# Altium schematic sheet MGT Banks 115-116.SchDoc
size A3; SheetNumber: 22; SheetTotal: 32
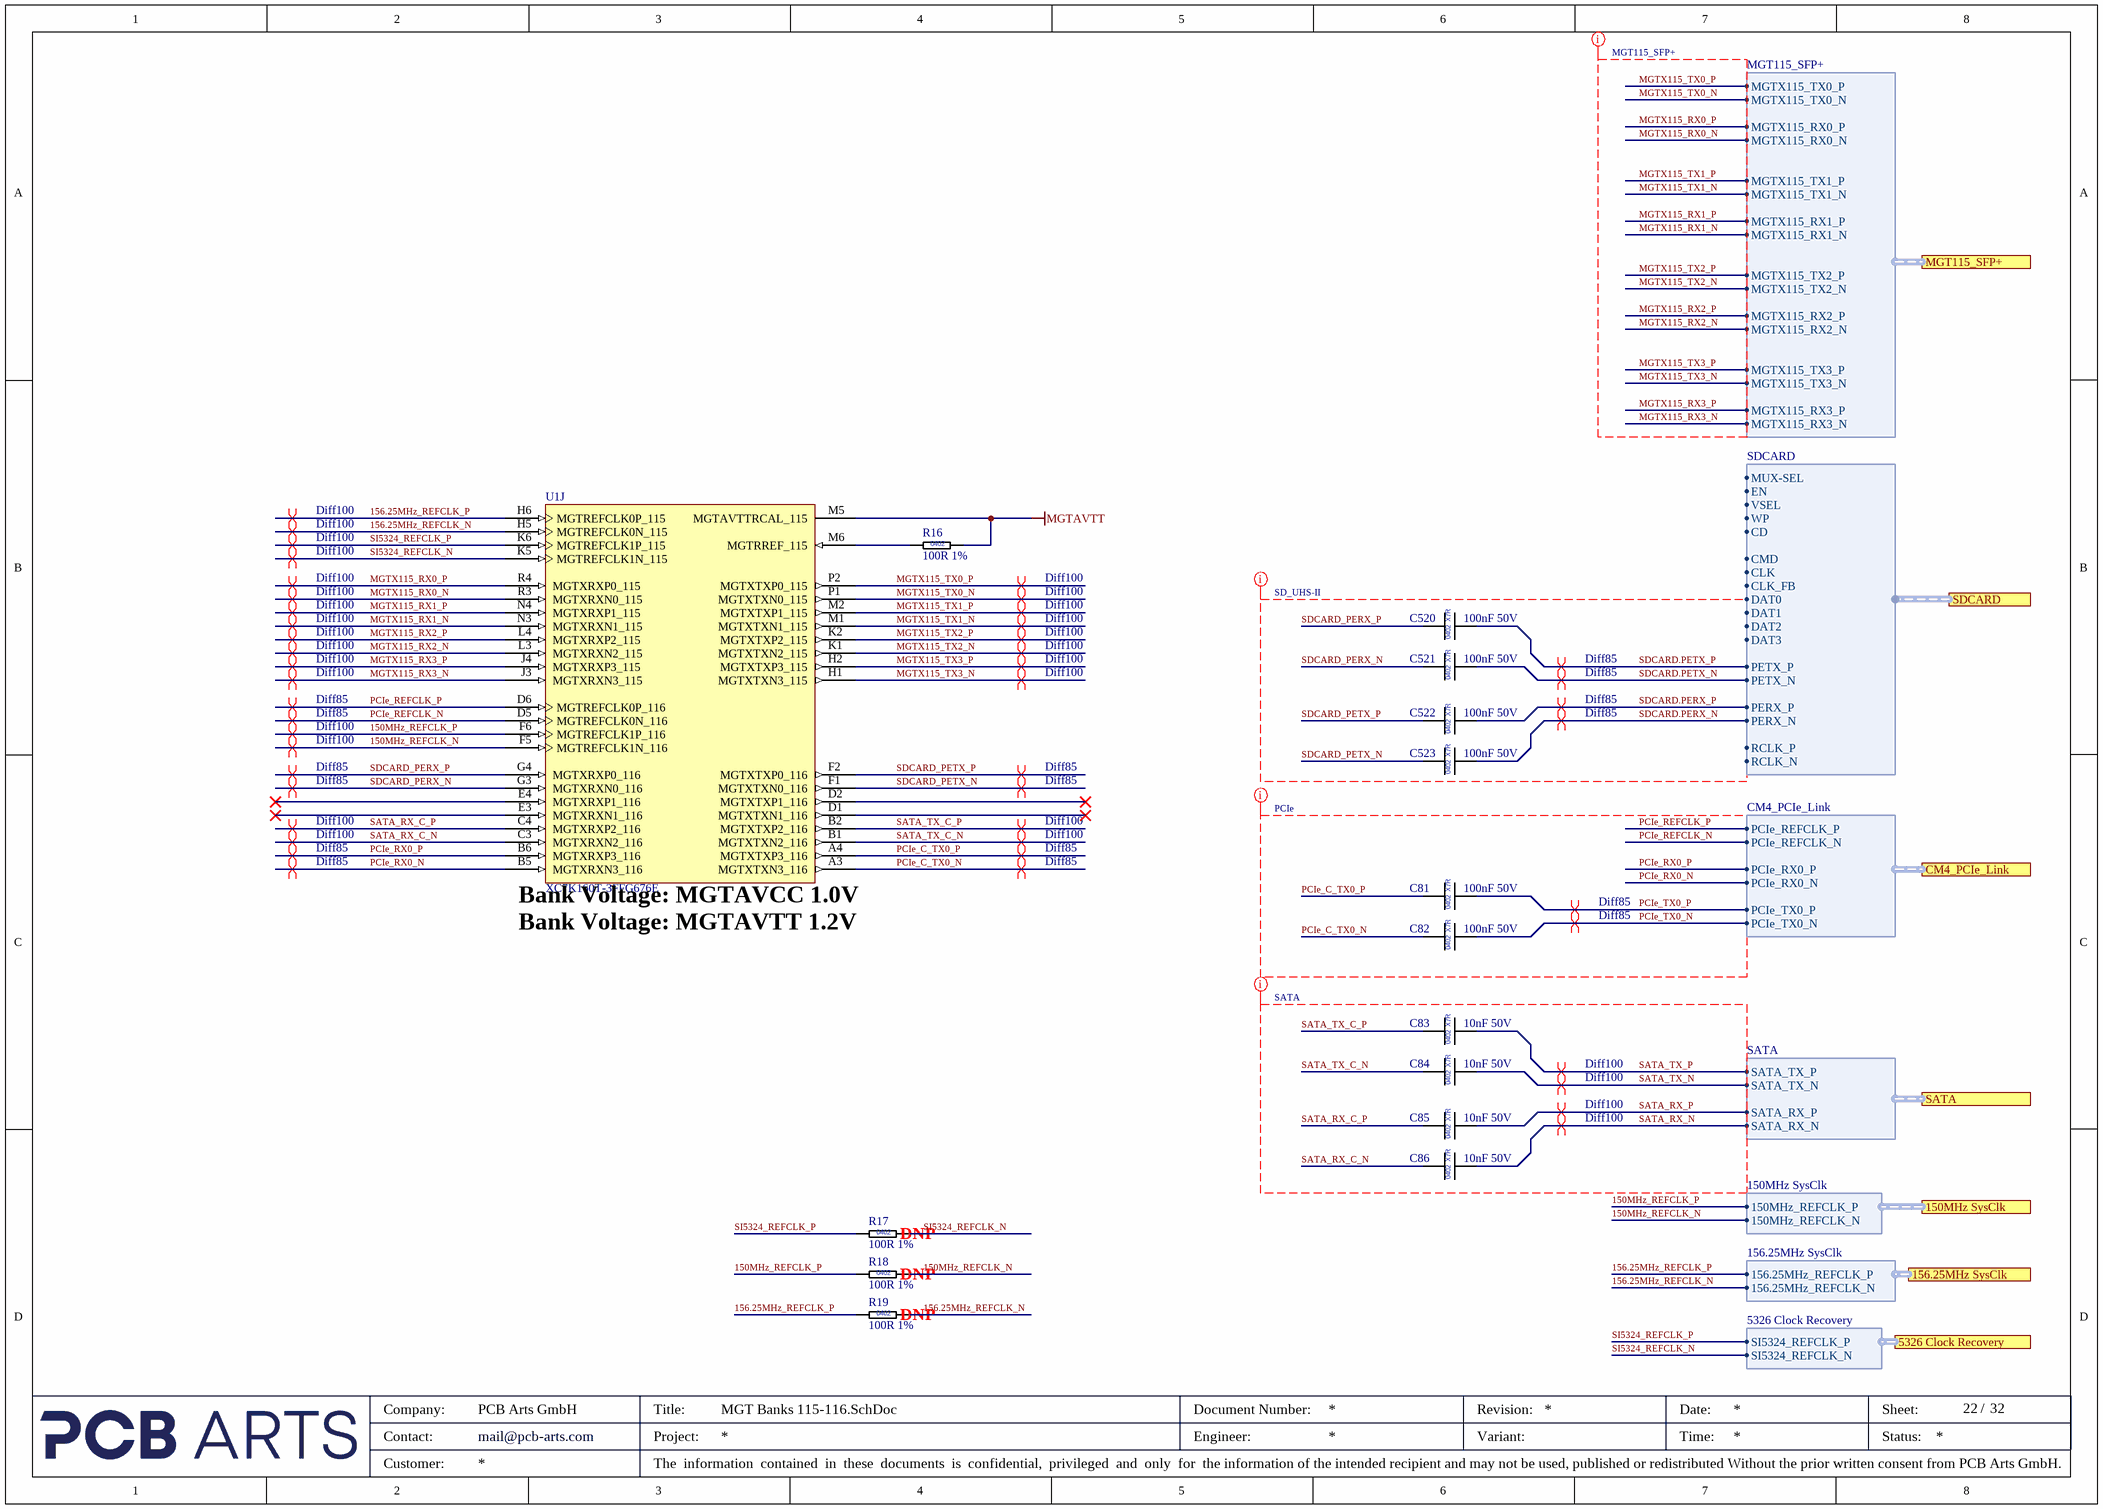
[diagram p0: MGT Banks 115-116.SchDoc]

## Parts
C81  100nF 50V  [CAP_0402_L]
C82  100nF 50V  [CAP_0402_L]
C83  10nF 50V  [CAP_0402_L]
C84  10nF 50V  [CAP_0402_L]
C85  10nF 50V  [CAP_0402_L]
C86  10nF 50V  [CAP_0402_L]
C520  100nF 50V  [CAP_0402_L]
C521  100nF 50V  [CAP_0402_L]
C522  100nF 50V  [CAP_0402_L]
C523  100nF 50V  [CAP_0402_L]
R16  100R 1%  [RES_0402_L]
R17  100R 1%  [RES_0402_L]  (no BOM)
R18  100R 1%  [RES_0402_L]  (no BOM)
R19  100R 1%  [RES_0402_L]  (no BOM)
U1  XC7K160T-3FFG676E  [BGA100P2700X2700X317-676N]  (part J of 14)

## Ports
150MHz SysClk (harness 150MHz SysClk, see Top-Level-Sheet[5B], System Clocks[8A]), 156.25MHz SysClk (harness 156.25MHz SysClk, see Top-Level-Sheet[5B], System Clocks[8A]), 5326 Clock Recovery (harness 5326 Clock Recovery, see Top-Level-Sheet[5B], System Clocks[8A]), CM4_PCIe_Link (harness CM4_PCIe_Link, see Top-Level-Sheet[5B], Raspberry Pi CM4[8B]), MGT115_SFP+ (harness MGT115_SFP+, see Top-Level-Sheet[5B], SFP+_Connectors[8A]), SATA (harness SATA, see Top-Level-Sheet[5B], SSD M.2_B-Key[8A]), SDCARD (harness SDCARD, see Top-Level-Sheet[5B], Memory-SD_UHS_II[1C], SMI Bank 12[1B])

## Harnesses
MGT115_SFP+: MGTX115_TX0_P, MGTX115_TX0_N, MGTX115_RX0_P, MGTX115_RX0_N, MGTX115_TX1_P, MGTX115_TX1_N, MGTX115_RX1_P, MGTX115_RX1_N, MGTX115_TX2_P, MGTX115_TX2_N, MGTX115_RX2_P, MGTX115_RX2_N, MGTX115_TX3_P, MGTX115_TX3_N, MGTX115_RX3_P, MGTX115_RX3_N
SATA: SATA_TX_P, SATA_TX_N, SATA_RX_P, SATA_RX_N
CM4_PCIe_Link: PCIe_REFCLK_P, PCIe_REFCLK_N, PCIe_RX0_P, PCIe_RX0_N, PCIe_TX0_P, PCIe_TX0_N
150MHz SysClk: 150MHz_REFCLK_P, 150MHz_REFCLK_N
5326 Clock Recovery: SI5324_REFCLK_P, SI5324_REFCLK_N
156.25MHz SysClk: 156.25MHz_REFCLK_P, 156.25MHz_REFCLK_N
SDCARD: MUX-SEL, EN, VSEL, WP, CD, CMD, CLK, CLK_FB, PETX_P, PETX_N, DAT0, DAT1, DAT2, DAT3, PERX_P, PERX_N, RCLK_P, RCLK_N

## Nets
MGTAVTT: R16.2 U1.M5(MGTAVTTRCAL_115)
150MHz_REFCLK_N: R18.2 U1.F5(MGTREFCLK1N_116) ; port 150MHz SysClk.150MHz_REFCLK_N
150MHz_REFCLK_P: R18.1 U1.F6(MGTREFCLK1P_116) ; port 150MHz SysClk.150MHz_REFCLK_P
156.25MHz_REFCLK_N: R19.2 U1.H5(MGTREFCLK0N_115) ; port 156.25MHz SysClk.156.25MHz_REFCLK_N
156.25MHz_REFCLK_P: R19.1 U1.H6(MGTREFCLK0P_115) ; port 156.25MHz SysClk.156.25MHz_REFCLK_P
MGTX115_RX0_N: U1.R3(MGTXRXN0_115) ; port MGT115_SFP+.MGTX115_RX0_N
MGTX115_RX0_P: U1.R4(MGTXRXP0_115) ; port MGT115_SFP+.MGTX115_RX0_P
MGTX115_RX1_N: U1.N3(MGTXRXN1_115) ; port MGT115_SFP+.MGTX115_RX1_N
MGTX115_RX1_P: U1.N4(MGTXRXP1_115) ; port MGT115_SFP+.MGTX115_RX1_P
MGTX115_RX2_N: U1.L3(MGTXRXN2_115) ; port MGT115_SFP+.MGTX115_RX2_N
MGTX115_RX2_P: U1.L4(MGTXRXP2_115) ; port MGT115_SFP+.MGTX115_RX2_P
MGTX115_RX3_N: U1.J3(MGTXRXN3_115) ; port MGT115_SFP+.MGTX115_RX3_N
MGTX115_RX3_P: U1.J4(MGTXRXP3_115) ; port MGT115_SFP+.MGTX115_RX3_P
MGTX115_TX0_N: U1.P1(MGTXTXN0_115) ; port MGT115_SFP+.MGTX115_TX0_N
MGTX115_TX0_P: U1.P2(MGTXTXP0_115) ; port MGT115_SFP+.MGTX115_TX0_P
MGTX115_TX1_N: U1.M1(MGTXTXN1_115) ; port MGT115_SFP+.MGTX115_TX1_N
MGTX115_TX1_P: U1.M2(MGTXTXP1_115) ; port MGT115_SFP+.MGTX115_TX1_P
MGTX115_TX2_N: U1.K1(MGTXTXN2_115) ; port MGT115_SFP+.MGTX115_TX2_N
MGTX115_TX2_P: U1.K2(MGTXTXP2_115) ; port MGT115_SFP+.MGTX115_TX2_P
MGTX115_TX3_N: U1.H1(MGTXTXN3_115) ; port MGT115_SFP+.MGTX115_TX3_N
MGTX115_TX3_P: U1.H2(MGTXTXP3_115) ; port MGT115_SFP+.MGTX115_TX3_P
PCIe_C_TX0_N: C82.1 U1.A3(MGTXTXN3_116)
PCIe_C_TX0_P: C81.1 U1.A4(MGTXTXP3_116)
PCIe_REFCLK_N: U1.D5(MGTREFCLK0N_116) ; port CM4_PCIe_Link.PCIe_REFCLK_N
PCIe_REFCLK_P: U1.D6(MGTREFCLK0P_116) ; port CM4_PCIe_Link.PCIe_REFCLK_P
PCIe_RX0_N: U1.B5(MGTXRXN3_116) ; port CM4_PCIe_Link.PCIe_RX0_N
PCIe_RX0_P: U1.B6(MGTXRXP3_116) ; port CM4_PCIe_Link.PCIe_RX0_P
PCIe_TX0_N: C82.2 ; port CM4_PCIe_Link.PCIe_TX0_N
PCIe_TX0_P: C81.2 ; port CM4_PCIe_Link.PCIe_TX0_P
SATA_RX_C_N: C86.1 U1.C3(MGTXRXN2_116)
SATA_RX_C_P: C85.1 U1.C4(MGTXRXP2_116)
SATA_RX_N: C86.2 ; port SATA.SATA_RX_N
SATA_RX_P: C85.2 ; port SATA.SATA_RX_P
SATA_TX_C_N: C84.1 U1.B1(MGTXTXN2_116)
SATA_TX_C_P: C83.1 U1.B2(MGTXTXP2_116)
SATA_TX_N: C84.2 ; port SATA.SATA_TX_N
SATA_TX_P: C83.2 ; port SATA.SATA_TX_P
SDCARD.PERX_N: C523.2 ; port SDCARD.PERX_N
SDCARD.PERX_P: C522.2 ; port SDCARD.PERX_P
SDCARD.PETX_N: C521.2 ; port SDCARD.PETX_N
SDCARD.PETX_P: C520.2 ; port SDCARD.PETX_P
SDCARD_PERX_N: C521.1 U1.G3(MGTXRXN0_116)
SDCARD_PERX_P: C520.1 U1.G4(MGTXRXP0_116)
SDCARD_PETX_N: C523.1 U1.F1(MGTXTXN0_116)
SDCARD_PETX_P: C522.1 U1.F2(MGTXTXP0_116)
SI5324_REFCLK_N: R17.2 U1.K5(MGTREFCLK1N_115) ; port 5326 Clock Recovery.SI5324_REFCLK_N
SI5324_REFCLK_P: R17.1 U1.K6(MGTREFCLK1P_115) ; port 5326 Clock Recovery.SI5324_REFCLK_P
NetR16_1: R16.1 U1.M6(MGTRREF_115)

Not connected (* = marked no-connect by the designer): U1 D1(MGTXTXN1_116)* D2(MGTXTXP1_116)* E3(MGTXRXN1_116)* E4(MGTXRXP1_116)*

## Layout directives
differential pair; net class Diff100: 150MHz_REFCLK_N, 150MHz_REFCLK_P, 156.25MHz_REFCLK_N, 156.25MHz_REFCLK_P, MGTX115_RX0_N, MGTX115_RX0_P, MGTX115_RX1_N, MGTX115_RX1_P, MGTX115_RX2_N, MGTX115_RX2_P, MGTX115_RX3_N, MGTX115_RX3_P, MGTX115_TX0_N, MGTX115_TX0_P, MGTX115_TX1_N, MGTX115_TX1_P, MGTX115_TX2_N, MGTX115_TX2_P, MGTX115_TX3_N, MGTX115_TX3_P, SATA_RX_C_N, SATA_RX_C_P, SATA_RX_N, SATA_RX_P, SATA_TX_C_N, SATA_TX_C_P, SATA_TX_N, SATA_TX_P, SI5324_REFCLK_N, SI5324_REFCLK_P
differential pair; net class Diff85: PCIe_C_TX0_N, PCIe_C_TX0_P, PCIe_REFCLK_N, PCIe_REFCLK_P, PCIe_RX0_N, PCIe_RX0_P, PCIe_TX0_N, PCIe_TX0_P, SDCARD.PERX_N, SDCARD.PERX_P, SDCARD.PETX_N, SDCARD.PETX_P, SDCARD_PERX_N, SDCARD_PERX_P, SDCARD_PETX_N, SDCARD_PETX_P
net class PCIe: PCIe_C_TX0_N, PCIe_C_TX0_P, PCIe_REFCLK_N, PCIe_REFCLK_P, PCIe_RX0_N, PCIe_RX0_P, PCIe_TX0_N, PCIe_TX0_P
net class SATA: SATA_RX_C_N, SATA_RX_C_P, SATA_RX_N, SATA_RX_P, SATA_TX_C_N, SATA_TX_C_P, SATA_TX_N, SATA_TX_P
net class MGT115_SFP+: MGTX115_RX0_N, MGTX115_RX0_P, MGTX115_RX1_N, MGTX115_RX1_P, MGTX115_RX2_N, MGTX115_RX2_P, MGTX115_RX3_N, MGTX115_RX3_P, MGTX115_TX0_N, MGTX115_TX0_P, MGTX115_TX1_N, MGTX115_TX1_P, MGTX115_TX2_N, MGTX115_TX2_P, MGTX115_TX3_N, MGTX115_TX3_P
net class SD_UHS-II: SDCARD.PERX_N, SDCARD.PERX_P, SDCARD.PETX_N, SDCARD.PETX_P, SDCARD_PERX_N, SDCARD_PERX_P, SDCARD_PETX_N, SDCARD_PETX_P

## Notes on the sheet
- (near U1) Bank Voltage: MGTAVCC 1.0V
- (near U1) Bank Voltage: MGTAVTT 1.2V
- (near R17) DNP
- (near R18) DNP
- (near R19) DNP
- Company:
- Contact:
- Customer:
- mail@pcb-arts.com
- PCB Arts GmbH
- Title:
- Project:
- The  information  contained  in  these  documents  is  confidential,  privileged  and  only  for  the information of the intended recipient and may not be used, published or redistributed Without the prior written consent from PCB Arts GmbH.
- Engineer:
- Document Number:
- Revision:
- Variant:
- Date:
- Time:
- Sheet:
- Status:
- /
- (in symbol CAP_0402_10nF_50V) X7R; 0402
- (in symbol CAP_0402_100nF_50V) X7R; 0402
- (in symbol RES_0402_100R_1%) 0402

## Library data of the parts
C81 C82 C520-C523 = CAP_0402_100nF_50V: Multilayer Ceramic Capacitors MLCC - SMD/SMT 0402 50VDC; Manufacturer 1: Murata Electronics; Manufacturer 1 Prt. Nr.: GCM155L8EH104KE07D; Manufacturer 2 Prt. Nr.: UMK105B7104KV-FR; Manufacturer 2: TDK
C83-C86 = CAP_0402_10nF_50V: Multilayer Ceramic Capacitors MLCC - SMD/SMT 0402 50VDC; Manufacturer 1: Wurth Elektronik; Manufacturer 1 Prt. Nr.: 885012205067; Manufacturer 2 Prt. Nr.: AC0402KPX7R9BB103; Manufacturer 2: Yageo
R16-R19 = RES_0402_100R_1%: Thick Film Resistors - SMD 100Ohm 1%; Manufacturer 1: Vishay / Dale; Manufacturer 1 Prt. Nr.: CRCW0402100RFKEE; Manufacturer 2 Prt. Nr.: RC0402FR-7W100RL; Manufacturer 2: Yageo
U1 = XC7K160T-3FFG676E_Kintex-7 FPGA, 400 User I/Os, 8 GTX, FFG676: Kintex-7 FPGA, 400 User I/Os, 8 GTX, 676-Ball BGA, Speed Grade 3, Extended Grade, Pb-Free; Manufacturer 1: Xilinx; Manufacturer 1 Prt. Nr.: XC7K160T-3FFG676E; ComponentLink1URL: http://www.xilinx.com/support/documentation/data_sheets/ds180_7Series_Overview.pdf; ComponentLink2URL: http://www.xilinx.com/support/documentation/user_guides/ug865-Zynq-7000-Pkg-Pinout.pdf; ComponentLink1Description: Datasheet; ComponentLink2Description: Package Specification